# EAGLE design THT (EAGLE 7.6.0)
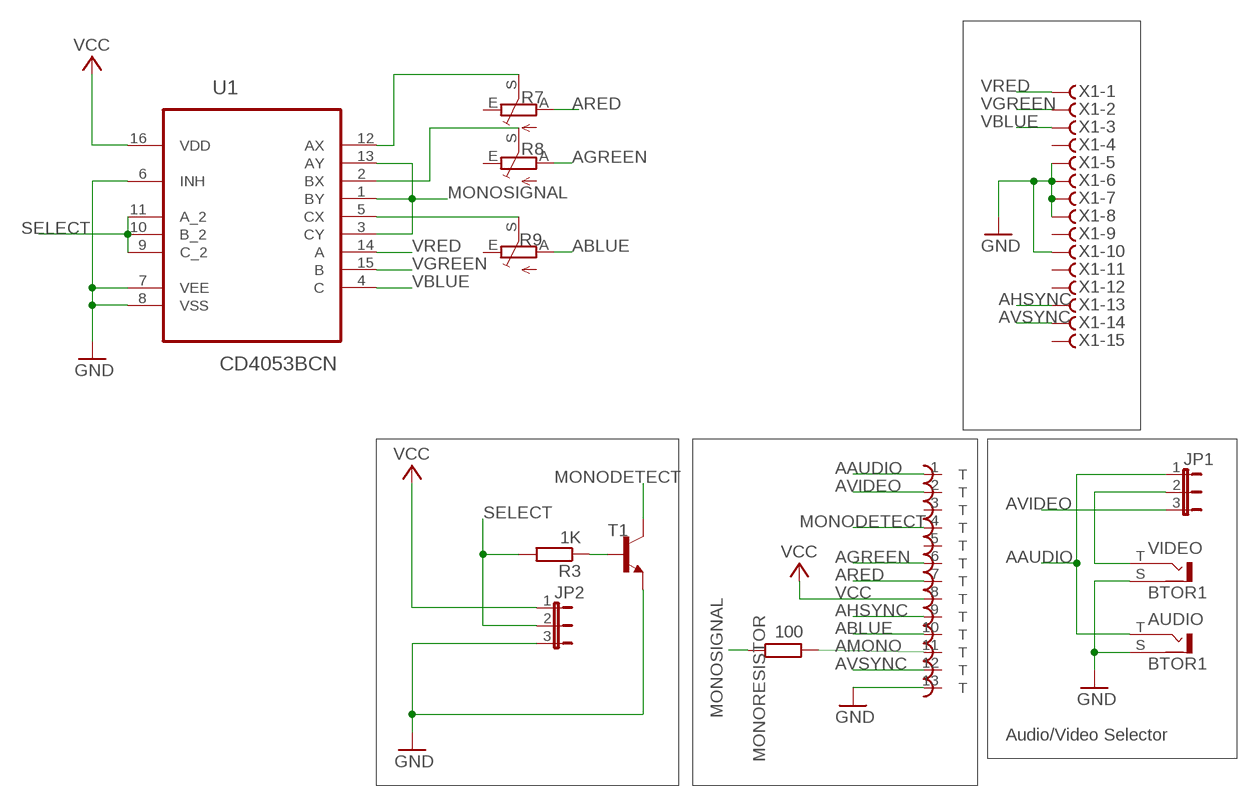
[diagram p0: schematic, sheet 1]

## Parts
ATARIOUT  DIN13T  [ADADS]
AUDIO  BTOR1  [BTOR1]
JP1  JP2E  [JP2]
JP2  JP2E  [JP2]
MONORESISTOR  100  R-EU_0207/2V  [0207/2V]
R3  1K  R-EU_0207/2V  [0207/2V]
R7  TRIM_EU-CA6H  [CA6H]
R8  TRIM_EU-CA6H  [CA6H]
R9  TRIM_EU-CA6H  [CA6H]
T1  2N3904-NPN-TO92-EBC  [TO92-EBC]
U1  CD4053BCN  [DIP254P762X508-16]
VIDEO  BTOR1  [BTOR1]
X1  F15HDVS  [HDF15V]

## Nets
AAUDIO: ATARIOUT.1 AUDIO.T JP1.1
ABLUE: ATARIOUT.10 R9.A
AGREEN: ATARIOUT.6 R8.A
AHSYNC: ATARIOUT.9 X1.13
AMONO: ATARIOUT.11 MONORESISTOR.2
ARED: ATARIOUT.7 R7.A
AVIDEO: ATARIOUT.2 JP1.3
AVSYNC: ATARIOUT.12 X1.14
GND: ATARIOUT.13 AUDIO.S JP2.3 T1.E U1.6(INH) U1.7(VEE) U1.8(VSS) VIDEO.S X1.5 X1.6 X1.7 X1.8 X1.10
MONODETECT: ATARIOUT.4 T1.C
MONOSIGNAL: MONORESISTOR.1 U1.1(BY) U1.3(CY) U1.13(AY)
N$1: R8.S U1.2(BX)
N$2: R9.S U1.5(CX)
N$3: JP1.2 VIDEO.T
N$7: R3.1 T1.B
N$9: R7.S U1.12(AX)
SELECT: JP2.2 R3.2 U1.9(C_2) U1.10(B_2) U1.11(A_2)
VBLUE: U1.4(C) X1.3
VCC: ATARIOUT.8 JP2.1 U1.16(VDD)
VGREEN: U1.15(B) X1.2
VRED: U1.14(A) X1.1
Unconnected: ATARIOUT.3 ATARIOUT.5 AUDIO.S@1 AUDIO.S@2 AUDIO.S@3 R7.E R8.E R9.E VIDEO.S@1 VIDEO.S@2 VIDEO.S@3 X1.4 X1.9 X1.11 X1.12 X1.15

## Notes on the sheet
- Audio/Video Selector

## Library data of the parts
ATARIOUT = ube:DIN13
AUDIO VIDEO = con-lumberg:BTOR1: RCA connectors according to JEITA RC-5231 Cinch RCA-Einbaukupplung nach JEITA RC-5231, stehende Ausführung Source: http://www.lumberg.de/Produkte/PDFs/BTOR1.pdf; OC_FARNELL: 1217030; OC_NEWARK: unknown
JP1 JP2 = jumper:JP2E: JUMPER
MONORESISTOR R3 = rcl:R-EU_: RESISTOR, European symbol
R7-R9 = pot:TRIM_EU-: POTENTIOMETER
T1 = transistor-neu-to92:*-NPN-: NPN Transistror
U1 = Fairchild_By_element14_Batch_1:CD4053BCN: Analog Multiplexer/Demultiplexer; MPN: CD4053BCN; OC_FARNELL: 1014042; OC_NEWARK: 58K8795; PACKAGE: PDIP-16; SUPPLIER: Fairchild
X1 = con-subd:F15?S: SUB-D; OC_FARNELL: unknown; OC_NEWARK: unknown

## Net classes
0 default: width 0.254 mm

## Board
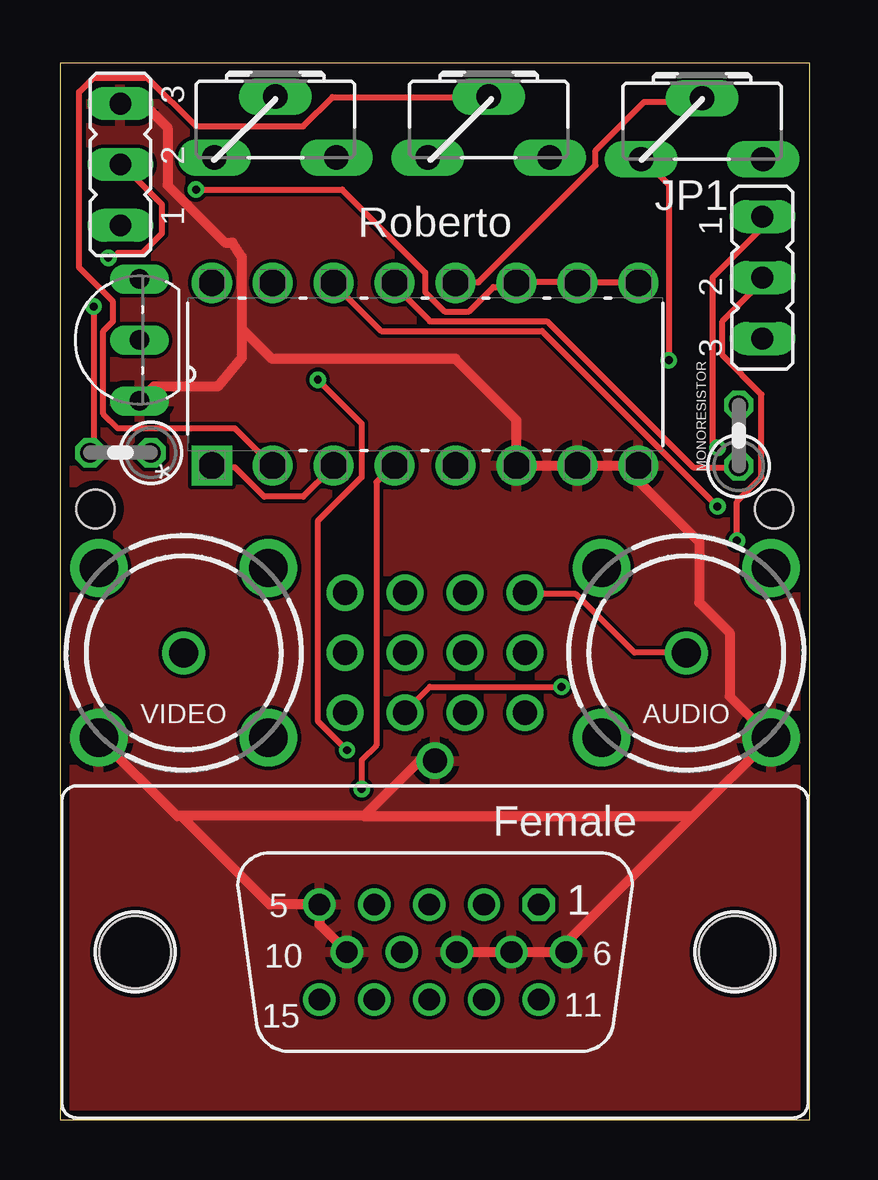
[diagram p1: board, top side]
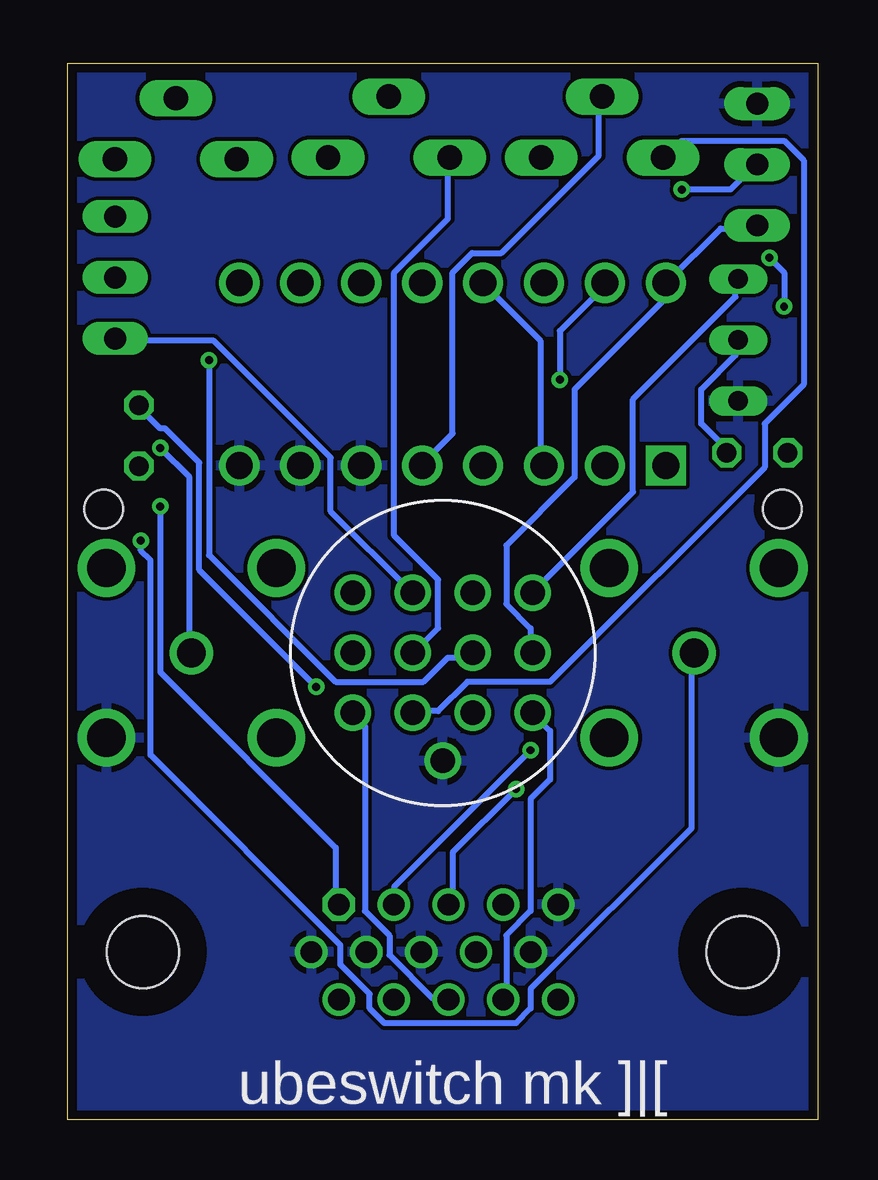
[diagram p2: board, bottom side, seen from below]

Size 31.27 x 44.05 mm. Coordinates in mm from the lower left corner, seen from the top.
Outline: 0,0 31.27,0 31.27,44.05 0,44.05 0,0
Copper layers (1*16): Top 0.0356mm / dielectric 1.5011mm / Bottom 0.0356mm
Design rules "PCBs_io": minimum track width 6mil, minimum drill 13mil, track to track 6mil, track to pad 6mil, pad to pad 6mil, via to via 6mil, smd to smd 6mil, copper to edge 15mil, drill to drill 6mil, minimum pad ring 7mil, minimum via ring 7mil, stop-mask expansion 3mil, vias tented up to drill 0mil, thermal gap 10mil
Holes 1.6 mm at 1.48,25.47 29.77,25.47

### Footprints (pad centres in the part's own frame; a part is rotated, then mirrored left to right if it is on the bottom)
ADADS = drill 1.016: 1 -3.75,2.5; 2 -1.25,2.5; 3 1.25,2.5; 4 3.75,2.5; 5 -3.75,0; 6 -1.25,0; 7 1.25,0; 8 3.75,0; 9 -3.75,-2.5; 10 -1.25,-2.5; 11 1.25,-2.5; 12 3.75,-2.5; 13 0,-4.5
BTOR1 = drill 1.6 pad 2.2: S -5,0; S@1 0,5; S@2 5,0; S@3 0,-5 | drill 1.2 pad 1.6: T 0,0
JP2 = drill 0.914 long: 1 -2.54,0; 2 0,0; 3 2.54,0
0207/2V = drill 0.813 octagon: 1 -1.27,0; 2 1.27,0
CA6H = drill 1.016 long: A -2.54,0; E 2.54,0; S 0,2.54
TO92-EBC = drill 0.813 long: B 0,-1.27; C 2.54,-1.27; E -2.54,-1.27
DIP254P762X508-16 = drill 1.118 square: 1 -7.62,17.78 | drill 1.118: 2 -7.62,15.24; 3 -7.62,12.7; 4 -7.62,10.16; 5 -7.62,7.62; 6 -7.62,5.08; 7 -7.62,2.54; 8 -7.62,0; 9 0,0; 10 0,2.54; 11 0,5.08; 12 0,7.62; 13 0,10.16; 14 0,12.7; 15 0,15.24; 16 0,17.78
HDF15V = drill 0.9 octagon: 1 4.329,1.98 | drill 0.9: 2 2.043,1.98; 3 -0.243,1.98; 4 -2.529,1.98; 5 -4.815,1.98; 6 5.472,0; 7 3.186,0; 8 0.9,0; 9 -1.386,0; 10 -3.672,0; 11 4.329,-1.98; 12 2.043,-1.98; 13 -0.243,-1.98; 14 -2.529,-1.98; 15 -4.815,-1.98 | hole 3: -12.5,0; 12.5,0

### Placement (x,y rotation side)
ATARIOUT  15.63,19.47 0 bottom
AUDIO  26.11,19.47 135 top
JP1  29.29,35.12 270 top
JP2  2.52,39.83 90 top
MONORESISTOR  28.3,28.53 90 top
R3  2.52,27.81 180 top
R7  26.76,40.05 0 top
R8  17.87,40.12 0 top
R9  8.98,40.12 0 top
T1  2.04,32.51 90 top
U1  24.11,34.89 90 top
VIDEO  5.16,19.47 45 top
X1  15.63,7 0 top

### Tracks (layer width: path | path; a pad name or v marks a point on that pad's centre or on a via)
AAUDIO  (via drill 0.33)
  Top 0.254: v27.41,28.01 27.21,28.21 27.21,35.12 29.24,37.16 29.24,37.56 JP1.1 | ATARIOUT.1 19.49,21.92 21.52,21.92 23.96,19.48 25.99,19.48 AUDIO.T
  Bottom 0.254: v27.41,28.01 26.19,26.79 26.19,19.48 AUDIO.T
ABLUE
  Bottom 0.254: ATARIOUT.10 16.85,17.04 15.83,17.04 14.61,18.26 11.16,18.26 2.21,27.2 2.21,29.03 0.59,30.65 0.59,40 1.4,40.81 5.67,40.81 6.28,40.2 R9.A
AGREEN
  Bottom 0.254: R8.A 15.42,40 15.42,37.56 17.66,35.33 17.66,24.35 15.83,22.52 15.83,20.49 16.85,19.48 ATARIOUT.6
AHSYNC
  Bottom 0.254: X1.13 15.42,5.05 16.03,5.05 17.86,6.88 17.86,7.69 18.88,8.71 18.88,16.43 19.28,16.84 ATARIOUT.9
AMONO  (via drill 0.33)
  Top 0.254: v20.91,18.05 15.42,18.05 14.41,17.04 ATARIOUT.11
  Bottom 0.254: v20.91,18.05 25.79,22.93 25.79,27.4 27.21,28.82 27.41,28.82 28.23,29.64 MONORESISTOR.2
ARED  (via drill 0.33)
  Top 0.254: v25.38,31.67 25.38,38.98 24.36,40 R7.A
  Bottom 0.254: v25.38,31.67 25.38,23.54 20.1,18.26 16.44,18.26 15.42,19.27 14.41,19.27 ATARIOUT.7
AVIDEO
  Bottom 0.254: JP1.3 29.24,32.48 25.18,32.48 20.3,27.61 20.3,25.37 17.05,22.12 ATARIOUT.2
AVSYNC
  Bottom 0.254: X1.14 12.99,5.05 12.99,7.69 11.97,8.71 11.97,13.38 11.16,14.19 11.16,16.23 11.77,16.84 ATARIOUT.12
GND
  Top 0.406: JP2.3 3.48,42.37 4.48,41.37 4.48,38.97 6.88,36.57 7.18,36.57 7.58,35.97 7.58,32.99 | 7.58,32.99 7.58,31.77 6.58,30.57 3.91,30.57 T1.E | 7.58,32.99 8.85,31.72 16.49,31.72 19.03,29.18 U1.6 U1.7 U1.8 24.11,26.64 26.65,24.1 26.65,21.56 27.92,20.29 27.92,17.66 AUDIO.S 26.38,12.67 | ATARIOUT.13 14.98,14.97 12.68,12.67 | 12.68,12.67 5.06,12.67 | 5.06,12.67 4.89,12.67 VIDEO.S | 12.68,12.67 26.38,12.67 | 26.38,12.67 21.11,7.39 X1.6 X1.7 X1.8 | 5.06,12.67 8.75,8.98 X1.5 10.82,8.15 X1.10
  pour Top: -0.02,-0.03 -0.02,45.69 31.73,45.69 31.73,-0.03
  pour Bottom: -0.02,45.69 31.73,45.69 31.73,-0.03 -0.02,-0.03
MONODETECT
  Bottom 0.254: T1.C 3.43,34.92 3.43,34.31 7.7,30.04 7.7,26.18 11.77,22.12 ATARIOUT.4
MONOSIGNAL
  Top 0.254: U1.1 6.48,27.2 7.3,27.2 8.51,25.98 10.14,25.98 11.36,27.2 U1.3 | MONORESISTOR.1 28.23,27.2 26.4,27.2 20.3,33.3 15.42,33.3 14,34.72 U1.13
  Bottom 0.254: U1.3 11.56,27.4 11.56,32.48 13.8,34.72 U1.13
N$1
  Top 0.254: R8.S 17.86,42.64 11.36,42.64 10.14,41.42 5.67,41.42 3.64,43.45 1.4,43.45 0.79,42.84 0.79,35.53 2.21,34.11 2.21,33.3 1.81,32.89 1.81,29.43 2.42,28.82 7.3,28.82 8.72,27.4 U1.2
N$2
  Bottom 0.254: R9.S 9.12,42.64 9.12,40.2 13.19,36.14 14.41,36.14 15.22,35.33 15.22,28.62 16.44,27.4 U1.5
N$3  (via drill 0.33)
  Top 0.254: v28.23,24.15 28.23,25.78 29.24,26.79 29.24,30.25 27.62,31.87 27.62,33.3 29.24,34.92 JP1.2
  Bottom 0.254: v28.23,24.15 28.23,23.74 27.82,23.34 27.82,15.21 19.89,7.29 19.89,6.47 18.67,5.25 18.67,4.64 18.07,4.03 12.58,4.03 11.97,4.64 11.97,5.46 5.26,12.16 5.26,19.27 VIDEO.T
N$7
  Bottom 0.254: T1.B 3.43,32.48 3.43,31.87 4.86,30.45 4.86,29.03 3.84,28.01 R3.1
N$9
  Top 0.254: R7.S 26.6,42.44 24.36,42.44 22.33,40.41 22.33,39.8 17.46,34.92 16.64,34.92 U1.12
SELECT  (via drill 0.33)
  Top 0.254: U1.9 23.96,34.92 21.72,34.92 U1.10 21.52,34.92 19.08,34.92 U1.11 18.88,34.72 18.07,34.72 17.05,33.7 16.03,33.7 15.22,34.51 15.22,35.33 11.77,38.78 v5.67,38.78 | v1.4,33.9 1.4,28.01 R3.2 | v2.01,35.94 2.21,35.94 2.42,36.14 3.43,36.14 4.25,36.95 4.25,38.17 2.62,39.8 JP2.2
  Bottom 0.254: v1.4,33.9 1.4,35.33 v2.01,35.94 | v5.67,38.78 3.64,38.78 2.62,39.8 JP2.2
VBLUE  (via drill 0.33)
  Top 0.254: v12.58,13.79 12.58,15.01 13.19,15.62 13.19,26.59 13.8,27.2 U1.4
  Bottom 0.254: v12.58,13.79 15.22,11.15 15.22,9.11 X1.3
VCC
  Bottom 0.254: JP2.1 2.62,37.16 4.04,37.16 6.28,34.92 U1.16 6.48,34.72 6.48,34.11 10.14,30.45 10.14,26.79 12.99,23.95 12.99,21.51 11.97,20.49 11.97,19.48 ATARIOUT.8
VGREEN  (via drill 0.33)
  Top 0.254: v11.97,15.41 10.75,16.63 10.75,24.96 12.58,26.79 12.58,29.03 v10.75,30.86
  Bottom 0.254: v11.97,15.41 17.66,9.72 17.66,9.11 X1.2 | v10.75,30.86 10.75,32.89 8.92,34.72 U1.15
VRED  (via drill 0.33)
  Top 0.254: v27.41,25.57 20.1,32.89 13.39,32.89 11.56,34.72 U1.14
  Bottom 0.254: v27.41,25.57 27.41,18.66 20.1,11.35 20.1,9.11 X1.1

### Text on the board
tNames: Roberto
bNames: ubeswitch mk ]|[
Document: Distance from PCB to surface. | Distance from PIN13 to bottom of case. | Distance from PIN13 to surface.